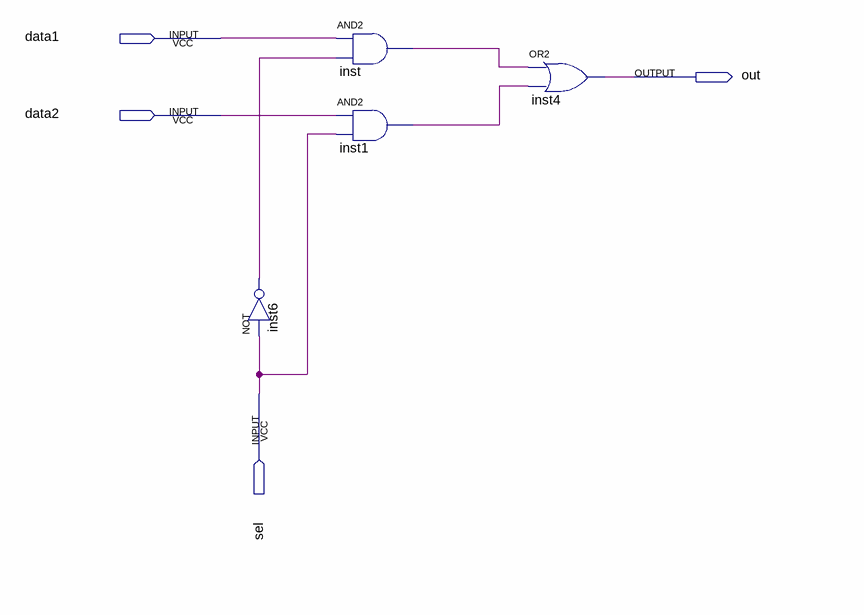
[diagram p0: schematic sheet]
// Quartus schematic fourbit_reg_sram.bdf as structural Verilog: 4 symbols, 4 pins
module fourbit_reg_sram (
  input  data1,
  input  data2,
  input  sel,
  output out
);

  wire inst1_out, inst6_out, inst_out;

  not inst6 (inst6_out, sel);
  and inst (inst_out, data1, inst6_out);
  and inst1 (inst1_out, data2, sel);
  or inst4 (out, inst_out, inst1_out);
endmodule
